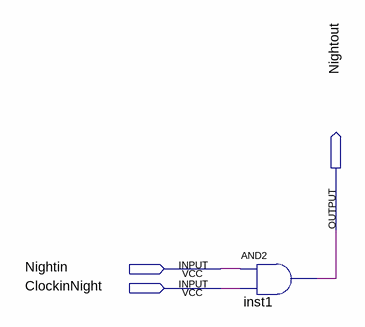
[diagram p0: schematic sheet]
// Quartus schematic MaquinadeStateNight.bdf as structural Verilog: 1 symbols, 3 pins
module MaquinadeStateNight (
  input  Nightin,
  input  ClockinNight,
  output Nightout
);

  and inst1 (Nightout, Nightin, ClockinNight);
endmodule
